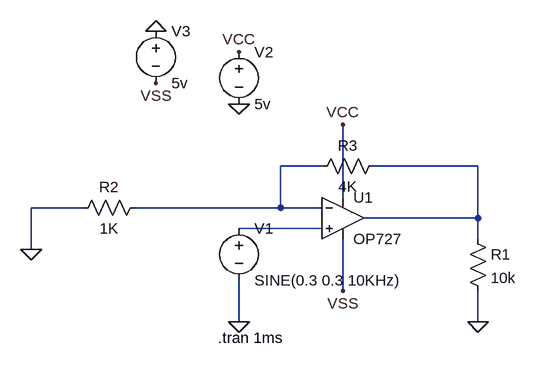
[diagram p0: schematic 6532142421-PB3.asc]
6532142421-PB3.asc, the LTspice schematic file:
Version 4
SHEET 1 880 680
WIRE 16 48 -48 48
WIRE 256 48 96 48
WIRE 48 96 48 -16
WIRE -352 112 -432 112
WIRE -48 112 -48 48
WIRE -48 112 -272 112
WIRE 16 112 -48 112
WIRE 256 128 256 48
WIRE 256 128 80 128
WIRE 16 144 -112 144
WIRE 256 160 256 128
WIRE -432 176 -432 112
WIRE 48 240 48 160
WIRE -112 288 -112 224
WIRE 256 288 256 240
FLAG 256 288 0
FLAG -112 288 0
FLAG 48 -16 VCC
FLAG -112 -128 VCC
FLAG -112 -48 0
FLAG -432 176 0
FLAG 48 240 VSS
FLAG -240 -160 0
FLAG -240 -80 VSS
SYMBOL res 240 144 R0
SYMATTR InstName R1
SYMATTR Value 10k
SYMBOL voltage -112 128 R0
WINDOW 123 0 0 Left 0
WINDOW 39 0 0 Left 0
SYMATTR InstName V1
SYMATTR Value SINE(0.3 0.3 10KHz)
SYMBOL voltage -112 -144 R0
WINDOW 123 0 0 Left 0
WINDOW 39 0 0 Left 0
SYMATTR InstName V2
SYMATTR Value 5v
SYMBOL OP727 48 64 R0
SYMATTR InstName U1
SYMBOL res -256 96 R90
WINDOW 0 0 56 VBottom 2
WINDOW 3 32 56 VTop 2
SYMATTR InstName R2
SYMATTR Value 1K
SYMBOL res 112 32 R90
WINDOW 0 0 56 VBottom 2
WINDOW 3 32 56 VTop 2
SYMATTR InstName R3
SYMATTR Value 4K
SYMBOL voltage -240 -176 R0
WINDOW 123 0 0 Left 0
WINDOW 39 0 0 Left 0
SYMATTR InstName V3
SYMATTR Value 5v
TEXT -144 312 Left 2 !.tran 1ms

The netlist it stands for:
* 6532142421-PB3.asc
R1 N002 0 10k
V1 N003 0 SINE(0.3 0.3 10KHz)
V2 VCC 0 5v
* U1: OP727 (symbol OP727 not available, pins judged from their places): In+=N003 In-=N001 V+=VCC V-=VSS OUT=N002
R2 N001 0 1K
R3 N002 N001 4K
V3 0 VSS 5v
.tran 1ms
.backanno
.end